# Altium schematic sheet Voiture.SchDoc
size A4; PageSetup: Record=PageOptions|CenterHorizontal=True|CenterVertical=True|PrintScale=1.00|XCorrection=1.00|YCorrection=1.00|PrintKind=1|BorderSize=5000000|LeftOffset=0|BottomOffset=0|Orientation=2|PaperLength=1000|PaperWidth=1000|Scale=100|PaperSource=15|PrintQuality=600|MediaType=1|DitherType=10|PaperKind=A4 (210 x 297 mm)|PrintScaleMode=1
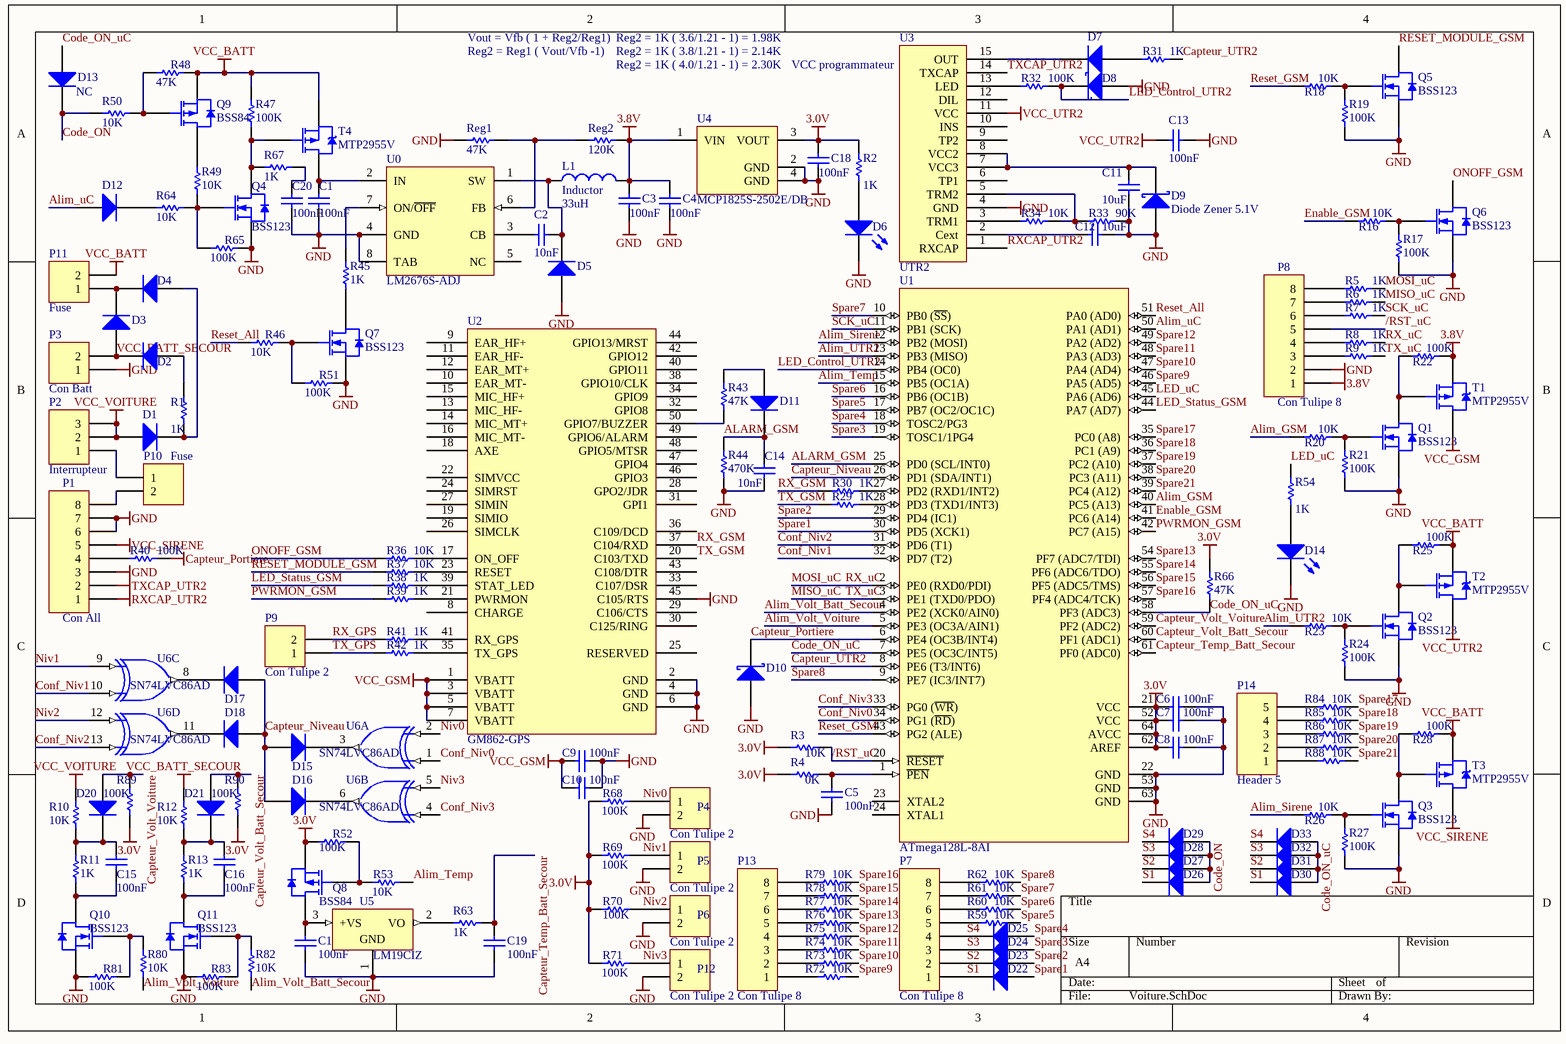
[diagram p0: Voiture.SchDoc]

## Parts
C1  value 100nF  [C1206]  (hidden comment: Cap 100nF)
C2  value 10nF  [C1206]  (hidden comment: Cap 10nF)
C3  value 100nF  [C1206]  (hidden comment: Cap 100nF)
C4  value 100nF  [C1206]  (hidden comment: Cap 100nF)
C5  value 100nF  [C1206]  (hidden comment: Cap 100nF)
C6  value 100nF  [C1206]  (hidden comment: Cap 100nF)
C7  value 100nF  [C1206]  (hidden comment: Cap 100nF)
C8  value 100nF  [C1206]  (hidden comment: Cap 100nF)
C9  value 100nF  [C1206]  (hidden comment: Cap 100nF)
C10  value 100nF  [C1206]  (hidden comment: Cap 100nF)
C11  value 10uF  [C1206]  (hidden comment: Cap 10uF)
C12  value 10uF  [C1206]  (hidden comment: Cap 10uF)
C13  value 100nF  [C1206]  (hidden comment: Cap 100nF)
C14  value 10nF  [C1206]  (hidden comment: Cap 10nF)
C15  value 100nF  [C1206]  (hidden comment: Cap 100nF)
C16  value 100nF  [C1206]  (hidden comment: Cap 100nF)
C17  value 100nF  [C1206]  (hidden comment: Cap 100nF)
C18  value 100nF  [C1206]  (hidden comment: Cap 100nF)
C19  value 100nF  [C1206]  (hidden comment: Cap 100nF)
C20  value 100nF  [C1206]  (hidden comment: Cap 100nF)
D1  Diode Power  [SMC]  (value not drawn)
D2  Diode Power  [SMC]  (value not drawn)
D3  Diode Power  [SMC]  (value not drawn)
D4  Diode Power  [SMC]  (value not drawn)
D5  Diode Power  [SMC]  (value not drawn)
D6  LED  [3.2X1.6X1.1]  (value not drawn)
D7  BAV103  [SOD80C]  (value not drawn)
D8  Diode Zener 3.0V  [SMB]  (value not drawn)
D9  Diode Zener 5.1V  [SMB]
D10  Diode Zener 3.0V  [SMB]  (value not drawn)
D11  BAV103  [SOD80C]  (value not drawn)
D12  BAV103  [SOD80C]  (value not drawn)
D13  NC  [SOD80C]
D14  LED  [3.2X1.6X1.1]  (value not drawn)
D15  BAV103  [SOD80C]  (value not drawn)
D16  BAV103  [SOD80C]  (value not drawn)
D17  BAV103  [SOD80C]  (value not drawn)
D18  BAV103  [SOD80C]  (value not drawn)
D20  BAV103  [SOD80C]  (value not drawn)
D21  BAV103  [SOD80C]  (value not drawn)
D22  BAV103  [SOD80C]  (value not drawn)
D23  BAV103  [SOD80C]  (value not drawn)
D24  BAV103  [SOD80C]  (value not drawn)
D25  BAV103  [SOD80C]  (value not drawn)
D26  BAV103  [SOD80C]  (value not drawn)
D27  BAV103  [SOD80C]  (value not drawn)
D28  BAV103  [SOD80C]  (value not drawn)
D29  BAV103  [SOD80C]  (value not drawn)
D30  BAV103  [SOD80C]  (value not drawn)
D31  BAV103  [SOD80C]  (value not drawn)
D32  BAV103  [SOD80C]  (value not drawn)
D33  BAV103  [SOD80C]  (value not drawn)
L1  Inductor  value 33uH  [4564_Chip]
P1  Con All  [HDR1X8]
P2  Interrupteur  [HDR1X3]
P3  Con Batt  [HDR1X2]
P4  Con Tulipe 2  [HDR1X2]
P5  Con Tulipe 2  [HDR1X2]
P6  Con Tulipe 2  [HDR1X2]
P7  Con Tulipe 8  [HDR1X8]
P8  Con Tulipe 8  [HDR1X8]
P9  Con Tulipe 2  [HDR1X2]
P10  Fuse  [HDR1X2]
P11  Fuse  [HDR1X2]
P12  Con Tulipe 2  [HDR1X2]
P13  Con Tulipe 8  [HDR1X8]
P14  Header 5  [HDR1X5]
Q1  BSS123  [SOT23_N]
Q2  BSS123  [SOT23_N]
Q3  BSS123  [SOT23_N]
Q4  BSS123  [SOT23_N]
Q5  BSS123  [SOT23_N]
Q6  BSS123  [SOT23_N]
Q7  BSS123  [SOT23_N]
Q8  BSS84  [SOT23_N]
Q9  BSS84  [SOT23_N]
Q10  BSS123  [SOT23_N]
Q11  BSS123  [SOT23_N]
R1  value 1K  [AXIAL-0.3]  (hidden comment: Res1)
R2  value 1K  [2012[0805]]  (hidden comment: Res Semi)
R3  value 10K  [2012[0805]]  (hidden comment: Res Semi)
R4  value 0K  [2012[0805]]  (hidden comment: Res Semi)
R5  value 1K  [2012[0805]]  (hidden comment: Res Semi)
R6  value 1K  [2012[0805]]  (hidden comment: Res Semi)
R7  value 1K  [2012[0805]]  (hidden comment: Res Semi)
R8  value 1K  [2012[0805]]  (hidden comment: Res Semi)
R9  value 1K  [2012[0805]]  (hidden comment: Res Semi)
R10  value 10K  [2012[0805]]  (hidden comment: Res Semi)
R11  value 1K  [2012[0805]]  (hidden comment: Res Semi)
R12  value 10K  [2012[0805]]  (hidden comment: Res Semi)
R13  value 1K  [2012[0805]]  (hidden comment: Res Semi)
R16  value 10K  [2012[0805]]  (hidden comment: Res Semi)
R17  value 100K  [2012[0805]]  (hidden comment: Res Semi)
R18  value 10K  [2012[0805]]  (hidden comment: Res Semi)
R19  value 100K  [2012[0805]]  (hidden comment: Res Semi)
R20  value 10K  [2012[0805]]  (hidden comment: Res Semi)
R21  value 100K  [2012[0805]]  (hidden comment: Res Semi)
R22  value 100K  [2012[0805]]  (hidden comment: Res Semi)
R23  value 10K  [2012[0805]]  (hidden comment: Res Semi)
R24  value 100K  [2012[0805]]  (hidden comment: Res Semi)
R25  value 100K  [2012[0805]]  (hidden comment: Res Semi)
R26  value 10K  [2012[0805]]  (hidden comment: Res Semi)
R27  value 100K  [2012[0805]]  (hidden comment: Res Semi)
R28  value 100K  [2012[0805]]  (hidden comment: Res Semi)
R29  value 1K  [2012[0805]]  (hidden comment: Res Semi)
R30  value 1K  [2012[0805]]  (hidden comment: Res Semi)
R31  value 1K  [2012[0805]]  (hidden comment: Res Semi)
R32  value 100K  [2012[0805]]  (hidden comment: Res Semi)
R33  value 90K  [2012[0805]]  (hidden comment: Res Semi)
R34  value 10K  [2012[0805]]  (hidden comment: Res Semi)
R36  value 10K  [2012[0805]]  (hidden comment: Res Semi)
R37  value 10K  [2012[0805]]  (hidden comment: Res Semi)
R38  value 1K  [2012[0805]]  (hidden comment: Res Semi)
R39  value 1K  [2012[0805]]  (hidden comment: Res Semi)
R40  value 100K  [2012[0805]]  (hidden comment: Res Semi)
R41  value 1K  [2012[0805]]  (hidden comment: Res Semi)
R42  value 1K  [2012[0805]]  (hidden comment: Res Semi)
R43  value 47K  [2012[0805]]  (hidden comment: Res Semi)
R44  value 470K  [2012[0805]]  (hidden comment: Res Semi)
R45  value 1K  [2012[0805]]  (hidden comment: Res Semi)
R46  value 10K  [2012[0805]]  (hidden comment: Res Semi)
R47  value 100K  [2012[0805]]  (hidden comment: Res Semi)
R48  value 47K  [2012[0805]]  (hidden comment: Res Semi)
R49  value 10K  [2012[0805]]  (hidden comment: Res Semi)
R50  value 10K  [2012[0805]]  (hidden comment: Res Semi)
R51  value 100K  [2012[0805]]  (hidden comment: Res Semi)
R52  value 100K  [2012[0805]]  (hidden comment: Res Semi)
R53  value 10K  [2012[0805]]  (hidden comment: Res Semi)
R54  value 1K  [2012[0805]]  (hidden comment: Res Semi)
R59  value 10K  [2012[0805]]  (hidden comment: Res Semi)
R60  value 10K  [2012[0805]]  (hidden comment: Res Semi)
R61  value 10K  [2012[0805]]  (hidden comment: Res Semi)
R62  value 10K  [2012[0805]]  (hidden comment: Res Semi)
R63  value 1K  [2012[0805]]  (hidden comment: Res Semi)
R64  value 10K  [2012[0805]]  (hidden comment: Res Semi)
R65  value 100K  [2012[0805]]  (hidden comment: Res Semi)
R66  value 47K  [2012[0805]]  (hidden comment: Res Semi)
R67  value 1K  [2012[0805]]  (hidden comment: Res Semi)
R68  value 100K  [2012[0805]]  (hidden comment: Res Semi)
R69  value 100K  [2012[0805]]  (hidden comment: Res Semi)
R70  value 100K  [2012[0805]]  (hidden comment: Res Semi)
R71  value 100K  [2012[0805]]  (hidden comment: Res Semi)
R72  value 10K  [2012[0805]]  (hidden comment: Res Semi)
R73  value 10K  [2012[0805]]  (hidden comment: Res Semi)
R74  value 10K  [2012[0805]]  (hidden comment: Res Semi)
R75  value 10K  [2012[0805]]  (hidden comment: Res Semi)
R76  value 10K  [2012[0805]]  (hidden comment: Res Semi)
R77  value 10K  [2012[0805]]  (hidden comment: Res Semi)
R78  value 10K  [2012[0805]]  (hidden comment: Res Semi)
R79  value 10K  [2012[0805]]  (hidden comment: Res Semi)
R80  value 10K  [2012[0805]]  (hidden comment: Res Semi)
R81  value 100K  [2012[0805]]  (hidden comment: Res Semi)
R82  value 10K  [2012[0805]]  (hidden comment: Res Semi)
R83  value 100K  [2012[0805]]  (hidden comment: Res Semi)
R84  value 10K  [2012[0805]]  (hidden comment: Res Semi)
R85  value 10K  [2012[0805]]  (hidden comment: Res Semi)
R86  value 10K  [2012[0805]]  (hidden comment: Res Semi)
R87  value 10K  [2012[0805]]  (hidden comment: Res Semi)
R88  value 10K  [2012[0805]]  (hidden comment: Res Semi)
R89  value 100K  [2012[0805]]  (hidden comment: Res Semi)
R90  value 100K  [2012[0805]]  (hidden comment: Res Semi)
Reg1  value 47K  [2012[0805]]  (hidden comment: Res Semi)
Reg2  value 120K  [2012[0805]]  (hidden comment: Res Semi)
T1  MTP2955V  [TO228P970-3_4N]
T2  MTP2955V  [TO228P970-3_4N]
T3  MTP2955V  [TO228P970-3_4N]
T4  MTP2955V  [TO228P970-3_4N]
U0  LM2676S-ADJ  [TS7B_N]
U1  ATmega128L-8AI  [64A_N]
U2  GM862-GPS  [GM862-GPS]
U3  UTR2  [utr2]
U4  MCP1825S-2502E/DB  [SOT-223-DB3_N]
U5  LM19CIZ  [Z03A]
U6  SN74LVC86AD  [D014_N]  (parts A,B,C,D of 4)

## Nets
3.0V: C6.2 C7.2 C8.2 C18.2 Q8.2(S) R2.2 R3.2 R4.2 R52.2 R66.2 R68.2 R69.2 R70.2 R71.2 R89.2 R90.2 U1.21(VCC) U1.52(VCC) U1.62(AREF) U1.64(AVCC) U4.3(VOUT) U6.14(VCC)
3.8V: C3.2 C4.2 L1.2 P8.1 R22.1 Reg2.1 T1.3(S) U4.1(VIN)
Capteur_Portiere: D10.2(K) R40.1 U1.6(PE4_(OC3B/INT4))
GND: C1.1 C3.1 C4.1 C5.1 C6.1 C7.1 C8.1 C9.1 C10.1 C11.2 C12.1 C13.2 C14.1 C17.1 C18.1 C19.1 C20.1 D5.1(A) D6.2(K) D8.1(A) D9.1(A) D10.1(A) D14.2(K) P1.3 P1.6 P1.7 P3.1 P4.2 P5.2 P6.2 P8.2 P12.2 Q1.2(S) Q2.2(S) Q3.2(S) Q4.2(S) Q5.2(S) Q6.2(S) Q7.2(S) Q10.2(S) Q11.2(S) R17.1 R19.1 R21.1 R24.2 R27.2 R33.2 R44.2 R51.1 R65.1 R81.2 R83.2 Reg1.2 U0.4(GND) U0.8(TAB) U1.22(GND) U1.53(GND) U1.63(GND) U2.2(GND) U2.4(GND) U2.6(GND) U2.45(C105/RTS) U3.4(GND) U4.2(GND) U4.4(GND) U5.1(GND) U6.7(GND)
RXCAP_UTR2: P1.1 U3.1(RXCAP)
TXCAP_UTR2: P1.2 U3.14(TXCAP)
VCC: U6.14(VCC)
VCC_BATT: P11.2 Q9.2(S) R25.1 R28.1 R47.1 R48.1 T2.3(S) T3.3(S) T4.3(S)
VCC_BATT_SECOUR: D2.2(K) D3.1(A) P3.2 R12.1
VCC_GSM: C9.2 C10.2 T1.2(D) U2.1(VBATT) U2.3(VBATT) U2.5(VBATT) U2.7(VBATT)
VCC_SIRENE: P1.5 T3.2(D)
VCC_UTR2: C13.1 T2.2(D) U3.11(VCC)
VCC_VOITURE: D1.1(A) P2.2 P2.3 R10.1
/RST_uC: P8.5 R3.1 U1.20(~{RESET})
ALARM_GSM: C14.2 D11.2(K) R44.1 U1.25(PD0_(SCL/INT0))
Alim_GSM: R20.2 U1.40(PC5_(A13))
Alim_Sirene: R26.2 U1.12(PB2_(MOSI))
Alim_Temp: R53.1 U1.15(PB5_(OC1A))
Alim_uC: D12.1(A) U1.50(PA1_(AD1))
Alim_UTR2: R23.2 U1.13(PB3_(MISO))
Alim_Volt_Batt_Secour: R82.2 U1.4(PE2_(XCK0/AIN0))
Alim_Volt_Voiture: R80.2 U1.5(PE3_(OC3A/AIN1))
Capteur_Niveau: D15.1(A) D16.1(A) D17.1(A) D18.1(A) U1.26(PD1_(SDA/INT1))
Capteur_Temp_Batt_Secour: C19.2 R63.2 U1.61(PF0_(ADC0))
Capteur_UTR2: R31.1 U1.8(PE6_(T3/INT6))
Capteur_Volt_Batt_Secour: D21.1(A) R90.1 U1.60(PF1_(ADC1))
Capteur_Volt_Voiture: D20.1(A) R89.1 U1.59(PF2_(ADC2))
Code_ON: D13.2(K) D26.1(A) D27.1(A) D28.1(A) D29.1(A) R50.2
Code_ON_uC: D13.1(A) D30.1(A) D31.1(A) D32.1(A) D33.1(A) R66.1 U1.7(PE5_(OC3C/INT5)) U1.58(PF3_(ADC3))
Conf_Niv0: U1.34(PG1_(~{RD})) U6.1(A)
Conf_Niv1: U1.32(PD7_(T2)) U6.10(B)
Conf_Niv2: U1.31(PD6_(T1)) U6.13(B)
Conf_Niv3: U1.33(PG0_(~{WR})) U6.4(A)
Enable_GSM: R16.2 U1.41(PC6_(A14))
LED_Control_UTR2: D8.2(K) R32.1 U1.14(PB4_(OC0))
LED_Status_GSM: R38.2 U1.44(PA7_(AD7))
LED_uC: R54.2 U1.45(PA6_(AD6))
MISO_uC: R6.1 R9.1 U1.3(PE1_(TXD0/PDO))  [also labelled TX_uC]
MOSI_uC: R5.1 R8.1 U1.2(PE0_(RXD0/PDI))  [also labelled RX_uC]
Niv0: P4.1 R68.1 U6.2(B)
Niv1: P5.1 R69.1 U6.9(A)
Niv2: P6.1 R70.1 U6.12(A)
Niv3: P12.1 R71.1 U6.5(B)
ONOFF_GSM: Q6.3(D) R36.2
PWRMON_GSM: R39.2 U1.42(PC7_(A15))
Reset_All: R46.2 U1.51(PA0_(AD0))
Reset_GSM: R18.2 U1.43(PG2_(ALE))
RESET_MODULE_GSM: Q5.3(D) R37.2
RX_GPS: P9.2 R41.2
RX_GSM: R30.2 U2.37(C104/RXD)
S1: D22.2(K) D26.2(K) D30.2(K) P7.1
S2: D23.2(K) D27.2(K) D31.2(K) P7.2
S3: D24.2(K) D28.2(K) D32.2(K) P7.3
S4: D25.2(K) D29.2(K) D33.2(K) P7.4
SCK_uC: R7.1 U1.11(PB1_(SCK))
Spare1: D22.1(A) U1.30(PD5_(XCK1))
Spare2: D23.1(A) U1.29(PD4_(IC1))
Spare3: D24.1(A) U1.19(TOSC1/1PG4)
Spare4: D25.1(A) U1.18(TOSC2/PG3)
Spare5: R59.1 U1.17(PB7_(OC2/OC1C))
Spare6: R60.1 U1.16(PB6_(OC1B))
Spare7: R61.1 U1.10(PB0_(~{SS}))
Spare8: R62.1 U1.9(PE7_(IC3/INT7))
Spare9: R72.1 U1.46(PA5_(AD5))
Spare10: R73.1 U1.47(PA4_(AD4))
Spare11: R74.1 U1.48(PA3_(AD3))
Spare12: R75.1 U1.49(PA2_(AD2))
Spare13: R76.1 U1.54(PF7_(ADC7/TDI))
Spare14: R77.1 U1.55(PF6_(ADC6/TDO))
Spare15: R78.1 U1.56(PF5_(ADC5/TMS))
Spare16: R79.1 U1.57(PF4_(ADC4/TCK))
Spare17: R84.1 U1.35(PC0_(A8))
Spare18: R85.1 U1.36(PC1_(A9))
Spare19: R86.1 U1.37(PC2_(A10))
Spare20: R87.1 U1.38(PC3_(A11))
Spare21: R88.1 U1.39(PC4_(A12))
TX_GPS: P9.1 R42.2
TX_GSM: R29.2 U2.20(C103/TXD)
NetC1_2: C1.2 T4.2(D) U0.2(IN)
NetC2_1: C2.1 D5.2(K) L1.1 U0.1(SW)
NetC2_2: C2.2 U0.3(CB)
NetC5_2: C5.2 R4.1 U1.1(~{PEN})
NetC11_1: C11.1 D9.2(K) U3.7(VCC3) U3.8(VCC2)
NetC12_2: C12.2 U3.2(Cext)
NetC15_1: C15.1 Q10.3(D) R11.2
NetC15_2: C15.2 D20.2(K) R10.2 R11.1
NetC16_1: C16.1 Q11.3(D) R13.2
NetC16_2: C16.2 D21.2(K) R12.2 R13.1
NetC17_2: C17.2 Q8.3(D) U5.3(+VS)
NetC20_2: C20.2 R67.1
NetD1_2: D1.2(K) D4.1(A) R1.1
NetD2_1: D2.1(A) R1.2
NetD3_2: D3.2(K) D4.2(K) P11.1
NetD6_1: D6.1(A) R2.1
NetD7_1: D7.1(A) R31.2
NetD7_2: D7.2(K) U3.15(OUT)
NetD11_1: D11.1(A) R43.1
NetD12_2: D12.2(K) R64.1
NetD14_1: D14.1(A) R54.1
NetD15_2: D15.2(K) U6.3(Y)
NetD16_2: D16.2(K) U6.6(Y)
NetD17_2: D17.2(K) U6.8(Y)
NetD18_2: D18.2(K) U6.11(Y)
NetP1_4: P1.4 R40.2
NetP1_8: P1.8 P10.2
NetP2_1: P2.1 P10.1
NetP7_5: P7.5 R59.2
NetP7_6: P7.6 R60.2
NetP7_7: P7.7 R61.2
NetP7_8: P7.8 R62.2
NetP8_3: P8.3 R9.2
NetP8_4: P8.4 R8.2
NetP8_6: P8.6 R7.2
NetP8_7: P8.7 R6.2
NetP8_8: P8.8 R5.2
NetP13_1: P13.1 R72.2
NetP13_2: P13.2 R73.2
NetP13_3: P13.3 R74.2
NetP13_4: P13.4 R75.2
NetP13_5: P13.5 R76.2
NetP13_6: P13.6 R77.2
NetP13_7: P13.7 R78.2
NetP13_8: P13.8 R79.2
NetP14_1: P14.1 R88.2
NetP14_2: P14.2 R87.2
NetP14_3: P14.3 R86.2
NetP14_4: P14.4 R85.2
NetP14_5: P14.5 R84.2
NetQ1_1: Q1.1(G) R20.1 R21.2
NetQ1_3: Q1.3(D) R22.2 T1.1(G)
NetQ2_1: Q2.1(G) R23.1 R24.1
NetQ2_3: Q2.3(D) R25.2 T2.1(G)
NetQ3_1: Q3.1(G) R26.1 R27.1
NetQ3_3: Q3.3(D) R28.2 T3.1(G)
NetQ4_1: Q4.1(G) R49.1 R64.2 R65.2
NetQ4_3: Q4.3(D) R47.2 R67.2 T4.1(G)
NetQ5_1: Q5.1(G) R18.1 R19.2
NetQ6_1: Q6.1(G) R16.1 R17.2
NetQ7_1: Q7.1(G) R46.1 R51.2
NetQ7_3: Q7.3(D) R45.1
NetQ8_1: Q8.1(G) R52.1 R53.2
NetQ9_1: Q9.1(G) R48.2 R50.1
NetQ9_3: Q9.3(D) R49.2
NetQ10_1: Q10.1(G) R80.1 R81.1
NetQ11_1: Q11.1(G) R82.1 R83.1
NetR29_1: R29.1 U1.28(PD3_(TXD1/INT3))
NetR30_1: R30.1 U1.27(PD2_(RXD1/INT2))
NetR32_2: R32.2 U3.13(LED)
NetR33_1: R33.1 R34.1 U3.5(TRM2)
NetR34_2: R34.2 U3.3(TRM1)
NetR36_1: R36.1 U2.17(ON_OFF)
NetR37_1: R37.1 U2.23(RESET)
NetR38_1: R38.1 U2.39(STAT_LED)
NetR39_1: R39.1 U2.21(PWRMON)
NetR41_1: R41.1 U2.41(RX_GPS)
NetR42_1: R42.1 U2.35(TX_GPS)
NetR43_2: R43.2 U2.50(GPIO7/BUZZER)
NetR45_2: R45.2 U0.7(ON/~{OFF})
NetR63_1: R63.1 U5.2(VO)
NetReg1_1: Reg1.1 Reg2.2 U0.6(FB)

Not connected (* = marked no-connect by the designer): U0 5(NC); U1 23(XTAL2) 24(XTAL1); U2 8(CHARGE) 9(EAR_HF+) 10(EAR_MT-) 11(EAR_HF-) 12(EAR_MT+) 13(MIC_HF-) 14(MIC_MT+) 15(MIC_HF+) 16(MIC_MT-) 18(AXE) 19(SIMIO) 22(SIMVCC) 24(SIMRST) 25(RESERVED) 26(SIMCLK) 27(SIMIN) 28(GPO2/JDR) 29(C106/CTS) 30(C125/RING) 31(GPI1) 32(GPIO8) 33(C107/DSR) 34(GPIO9) 36(C109/DCD) 38(GPIO10/CLK) 40(GPIO11) 42(GPIO12) 43(C108/DTR) 44(GPIO13/MRST) 46(GPIO3) 47(GPIO4) 48(GPIO5/MTSR) 49(GPIO6/ALARM); U3 6(TP1) 9(TP2) 10(INS) 12(DIL)

## Notes on the sheet
- Vout = Vfb ( 1 + Reg2/Reg1)
- Reg2 = 1K ( 3.6/1.21 - 1) = 1.98K
- Reg2 = Reg1 ( Vout/Vfb -1)
- Reg2 = 1K ( 3.8/1.21 - 1) = 2.14K
- Reg2 = 1K ( 4.0/1.21 - 1) = 2.30K
- VCC programmateur

## Library data of the parts
C1-C20 = Cap Semi: Capacitor (Semiconductor SIM Model); Published: 8-Jun-2000; LatestRevisionDate: 17-Jul-2002; LatestRevisionNote: Re-released for DXP Platform.; PackageReference: C1206; Publisher: Altium Limited
D1-D5 = Diode: Default Diode; Published: 8-Jun-2000; LatestRevisionDate: 17-Jul-2002; LatestRevisionNote: Re-released for DXP Platform.; PackageDocument: Sep-1996; PackageReference: SMC; Publisher: Altium Limited; Code_JEDEC: DO-214-AB
D6 D14 = LED2: Typical RED, GREEN, YELLOW, AMBER GaAs LED; Published: 8-Jun-2000; LatestRevisionDate: 17-Jul-2002; LatestRevisionNote: Re-released for DXP Platform.; PackageDocument: Feb-2002; PackageReference: 3.2X1.6X1.1; Publisher: Altium Limited
D7 D11-D13 D15-D18 D20-D33 = BAV103: General-purpose Diode; Published: 17-Sep-2003; LatestRevisionDate: 19-Mar-2004; LatestRevisionNote: Silkscreen size reduced.; DatasheetVersion: 17-Sep-1996; PackageVersion: Jan-2002; PackageReference: SOD80C; Publisher: Altium Limited; PackageDescription: Metal Electrode Face (MELF) Diode; Body 3.5 x 1.6 mm (LxDia); ComponentLink1Description: Manufacturer Link; ComponentLink1URL: http://www.semiconductors.philips.com/; ComponentLink2Description: Datasheet; ComponentLink2URL: http://www.semiconductors.philips.com/acrobat/datasheets/BAV100_2.pdf
D8-D10 = D Schottky: Schottky Diode; Published: 8-Jun-2000; LatestRevisionDate: 17-Jul-2002; LatestRevisionNote: Re-released for DXP Platform.; PackageReference: SMB; Publisher: Altium Limited; Code_JEDEC: DO-214-AA
L1 = Inductor: Code_IEC: 1005; Published: 8-Jun-2000; LatestRevisionDate: 17-Jul-2002; LatestRevisionNote: Re-released for DXP Platform.; PackageReference: 0402-A; Publisher: Altium Limited; Code_JEITA: 0402
P1 P7 P8 P13 = Header 8: Header, 8-Pin; LatestRevisionDate: 17-Jul-2002; LatestRevisionNote: Re-released for DXP Platform.; Publisher: Altium Limited
P2 = Header 3: Header, 3-Pin; LatestRevisionDate: 17-Jul-2002; LatestRevisionNote: Re-released for DXP Platform.; Publisher: Altium Limited
P3-P6 P9-P12 = Header 2: Header, 2-Pin; LatestRevisionDate: 17-Jul-2002; LatestRevisionNote: Re-released for DXP Platform.; Publisher: Altium Limited
P14 = Header 5: Header, 5-Pin; LatestRevisionDate: 17-Jul-2002; LatestRevisionNote: Re-released for DXP Platform.; Publisher: Altium Limited
Q1-Q7 Q10 Q11 = BSS123: N-channel Enhancement Mode Vertical D-MOSFET; Published: 17-Sep-2003; LatestRevisionDate: 12-Dec-2006; LatestRevisionNote: IPC-7351 Footprint Added.; DatasheetVersion: Apr-1995; PackageVersion: May-1999; PackageReference: SOT23; Publisher: Altium Limited; PackageDescription: 3-Pin SOT-23 Package 0.95 mm Pitch, 2.3 mm Lead Span; ComponentLink1Description: Manufacturer Link; ComponentLink1URL: http://www.semiconductors.philips.com/; ComponentLink2Description: Datasheet; ComponentLink2URL: http://www.semiconductors.philips.com/acrobat/datasheets/BSS123_3.pdf
Q8 Q9 = BSS84: P-channel Enhancement Mode Vertical D-MOSFET; Published: 17-Sep-2003; LatestRevisionDate: 12-Dec-2006; LatestRevisionNote: IPC-7351 Footprint Added.; DatasheetVersion: 18-Jun-1997; PackageVersion: May-1999; PackageReference: SOT23; Publisher: Altium Limited; PackageDescription: 3-Pin SOT-23 Package 0.95 mm Pitch, 2.3 mm Lead Span; ComponentLink1Description: Manufacturer Link; ComponentLink1URL: http://www.semiconductors.philips.com/; ComponentLink2Description: Datasheet; ComponentLink2URL: http://www.semiconductors.philips.com/acrobat/datasheets/BSS84_3.pdf
R1 = Res1: Resistor; Published: 8-Jun-2000; LatestRevisionDate: 17-Jul-2002; LatestRevisionNote: Re-released for DXP Platform.; PackageReference: AXIAL-0.3; Publisher: Altium Limited
R2-R13 R16-R34 R36-R54 R59-R90 Reg1 Reg2 = Res Semi: Semiconductor Resistor; Published: 8-Jun-2000; LatestRevisionDate: 17-Jul-2002; LatestRevisionNote: Re-released for DXP Platform.; PackageReference: AXIAL-0.5; Publisher: Altium Limited
T1-T4 = MTP2955V: TMOS V Power Field Effect Transistor; pin to pad: 2>4; Note: Pin 2 is electrically connected to Pin 4 (TAB); ComponentAvailability: Obsolete; Published: 29-Sep-2000; LatestRevisionDate: 17-Jul-2002; LatestRevisionNote: Re-released for DXP Platform.; DatasheetVersion: 1997; PackageVersion: 1997; PackageReference: 221A-09; Publisher: Altium Limited; PackageDescription: TO, Thru-Hole, Vertical, Heatsink Mounted; 3 In-Line Leads; Pitch 2.54 mm; Code_JEDEC: TO-262-AA; ComponentLink1Description: Manufacturer Link; ComponentLink1URL: http://www.onsemi.com/site/products/landing?taxonomyID=194; ComponentLink2Description: Datasheet; ComponentLink2URL: http://www.onsemi.com/pub/Collateral/MTP2955V-D.PDF
U0 = LM2676S-ADJ: SIMPLE SWITCHER High Efficiency 3A Step-Down Voltage Regulator; Manufacturer: National Semiconductor; PackageTopMarking: NSUZXYTT*LM2676*S-ADJ; Published: 4-Dec-2008; PackageVersion: revE, Jul-2003; PackageReference: TS7B; Publisher: Altium Limited; PackageDescription: TO-263, Molded, .400 x .390 x .180in Body, 7 Lead, .050in Pitch, Surface Mount; CompType: Switcher; PartNumber: LM2676S-ADJ; RoHS: O; PinCount: 7; DigiKeyPartNumber: LM2676S-ADJ-ND; Code_JEDEC: MO-169-AC; ComponentLink1Description: LM2676 Datasheet; ComponentLink1URL: http://www.national.com/ds/LM/LM2676.pdf; ComponentLink2Description: LM2676 Web Page; ComponentLink2URL: http://www.national.com/pf/LM/LM2676.html; ComponentLink3Description: TS7B Package Page; ComponentLink3URL: http://www.national.com/packaging/folders/ts7b.html
U1 = ATmega128L-8AI: 8-Bit AVR Microcontroller with 128K Bytes of In-System Programmable Flash Memory; Published: 17-Sep-2003; LatestRevisionDate: 13-Apr-2006; LatestRevisionNote: IPC-7351 Footprint Added.; DatasheetVersion: 2467G-AVR-09/02; PackageVersion: revB, Oct-2001; PackageReference: 64A; Publisher: Altium Limited; PackageDescription: 64-Pin Thin Quad Flat Pack 0.8 mm Pitch; Code_JEDEC: MS-026-AEB; ComponentLink1Description: Manufacturer Link; ComponentLink1URL: http://www.atmel.com; ComponentLink2Description: Datasheet; ComponentLink2URL: http://www.atmel.com/dyn/resources/prod_documents/doc2467.pdf
U4 = MCP1825S-2502E/DB: 500 mA, Low Voltage, Low Quiescent Current LDO Regulator, 3-Pin SOT-223, Extended Temperature; Published: 29-Jan-2009; DatasheetVersion: revB, Feb-2008; PackageVersion: revAW, Oct-2008; PackageReference: SOT-223-DB3; Publisher: Altium Limited; PackageDescription: 3-Lead Plastic Small Outline Transistor (DB) [SOT-223]; ComponentLink1Description: Manufacturer Link; ComponentLink1URL: http://www.microchip.com; ComponentLink2Description: Datasheet; ComponentLink2URL: http://ww1.microchip.com/downloads/en/DeviceDoc/22056b.pdf; ComponentLink3Description: Packaging Specification; ComponentLink3URL: http://ww1.microchip.com/downloads/en/PackagingSpec/00049AW.pdf
U5 = LM19CIZ: 2.4V, 10uA, TO-92 Temperature Sensor; Manufacturer: National Semiconductor; CompType: Temp Sensor IC; PackageTopMarking: NSXYTT*LM19*CIZ; Published: 4-Dec-2008; DatasheetVersion: Oct-2007; PackageVersion: revG, Sep-2000; PackageReference: Z03A; Publisher: Altium Limited; PackageDescription: TO-92, Molded, 3 Lead; PartNumber: LM19CIZ; RoHS: O; PinCount: 3; DigiKeyPartNumber: LM19CIZ-ND; Code_JEDEC: TO-226-AA; ComponentLink1Description: LM19 Datasheet; ComponentLink1URL: http://www.national.com/ds/LM/LM19.pdf; ComponentLink2Description: LM19 Web Page; ComponentLink2URL: http://www.national.com/pf/LM/LM19.html; ComponentLink3Description: Z03A Package Page; ComponentLink3URL: http://www.national.com/packaging/folders/z03a.html
U6 = SN74LVC86AD: Quadruple 2-Input Exclusive-OR Gate; Published: 8-Jun-2000; LatestRevisionDate: 13-Apr-2006; LatestRevisionNote: IPC-7351 Footprint Added.; DatasheetVersion: Oct-1998; PackageVersion: Jan-1998; PackageReference: D014; Publisher: Altium Limited; PackageDescription: 14-Pin Small Outline Integrated Circuit 1.27 mm Pitch; Code_IPC: SOIC127P600-14; ComponentLink1Description: Manufacturer Link; ComponentLink1URL: http://www.ti.com/; ComponentLink2Description: Datasheet; ComponentLink2URL: http://www-s.ti.com/sc/ds/SN54LVC86A.pdf